# Altium schematic sheet Power.SchDoc
size A2
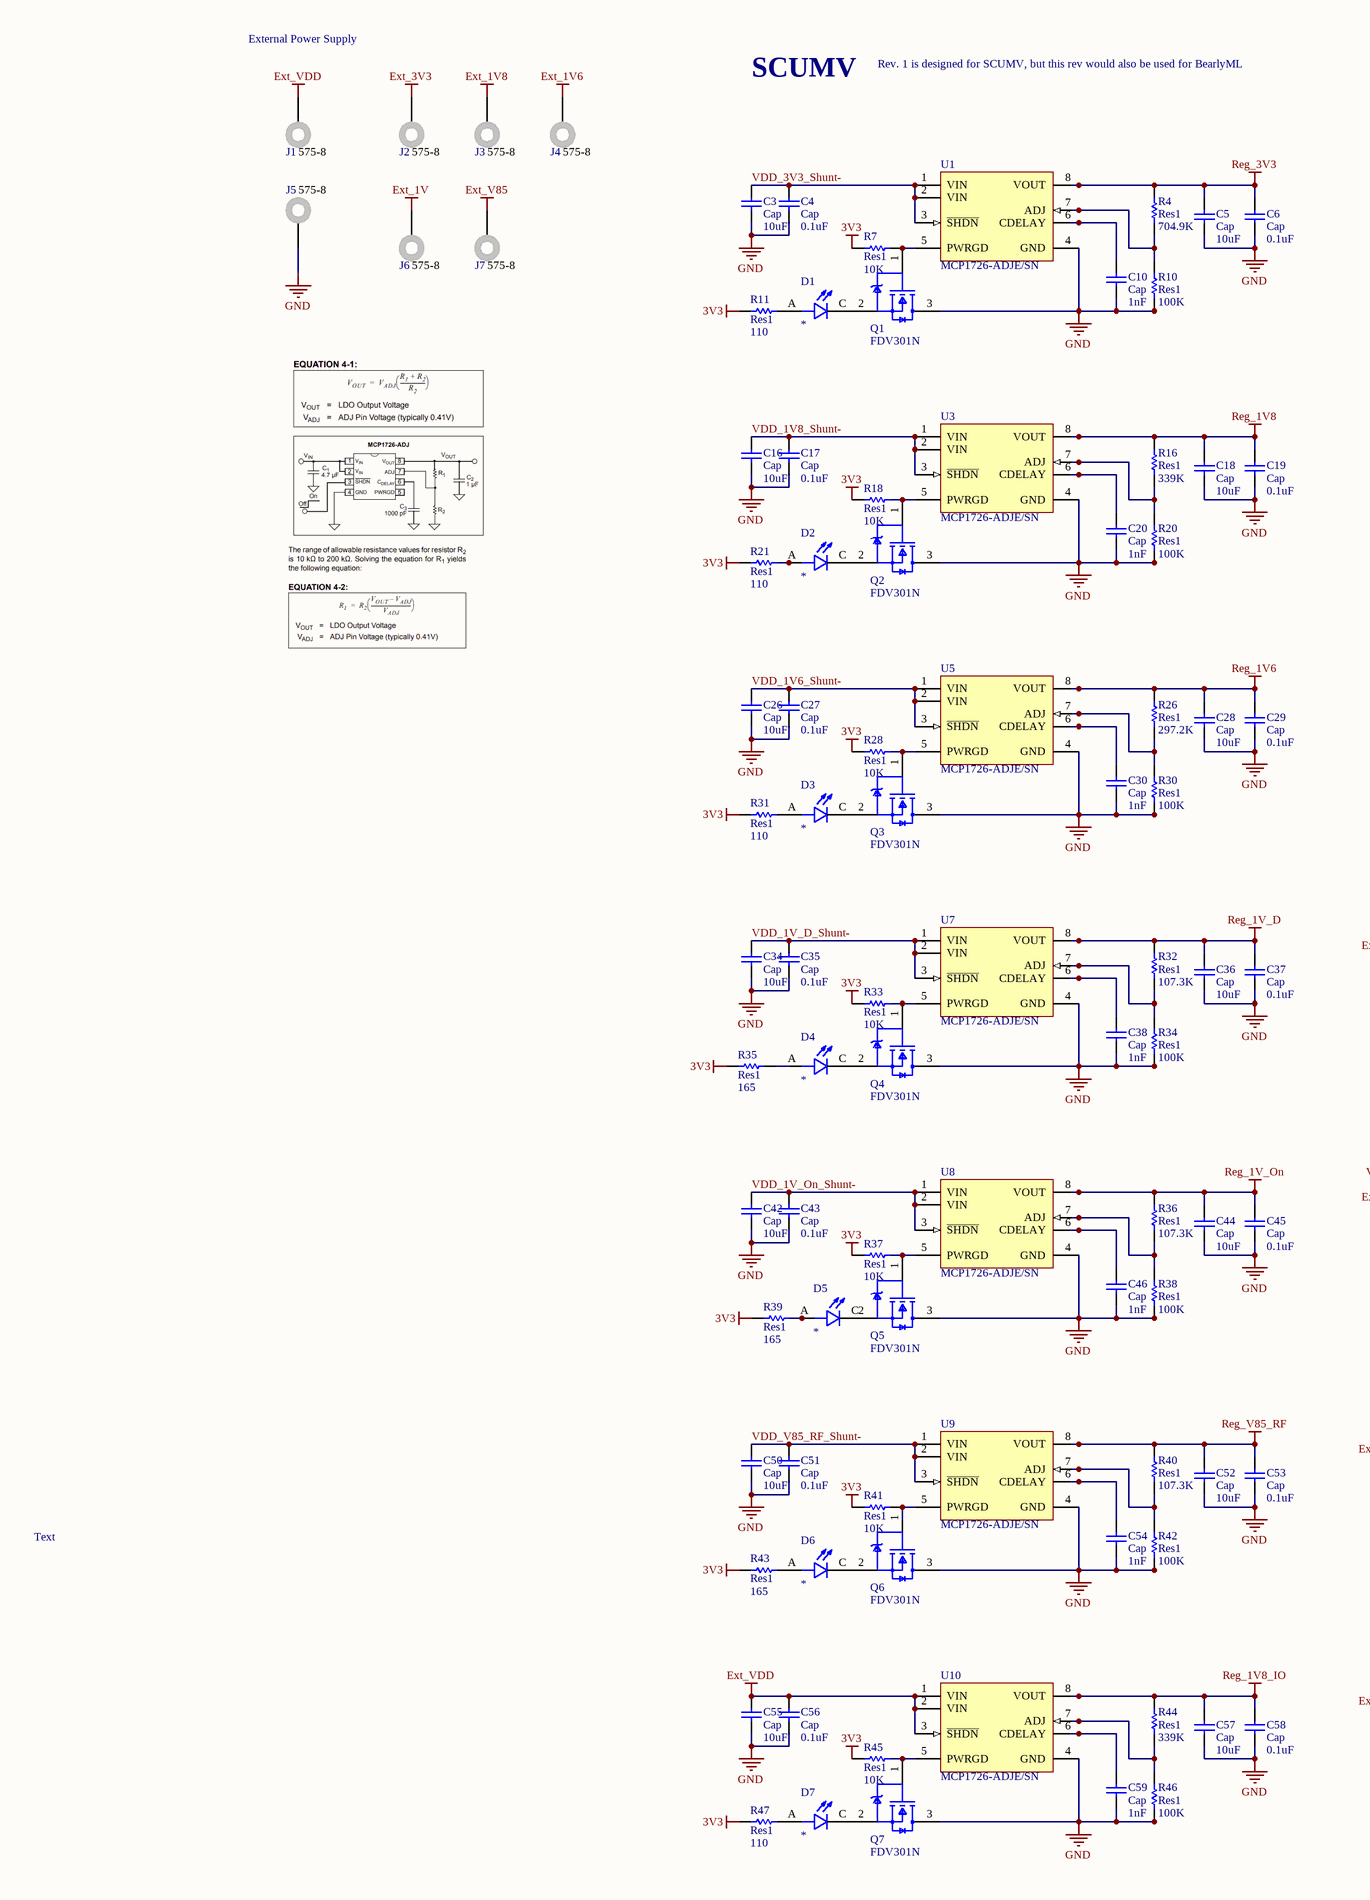
[diagram p0: Power.SchDoc, left]
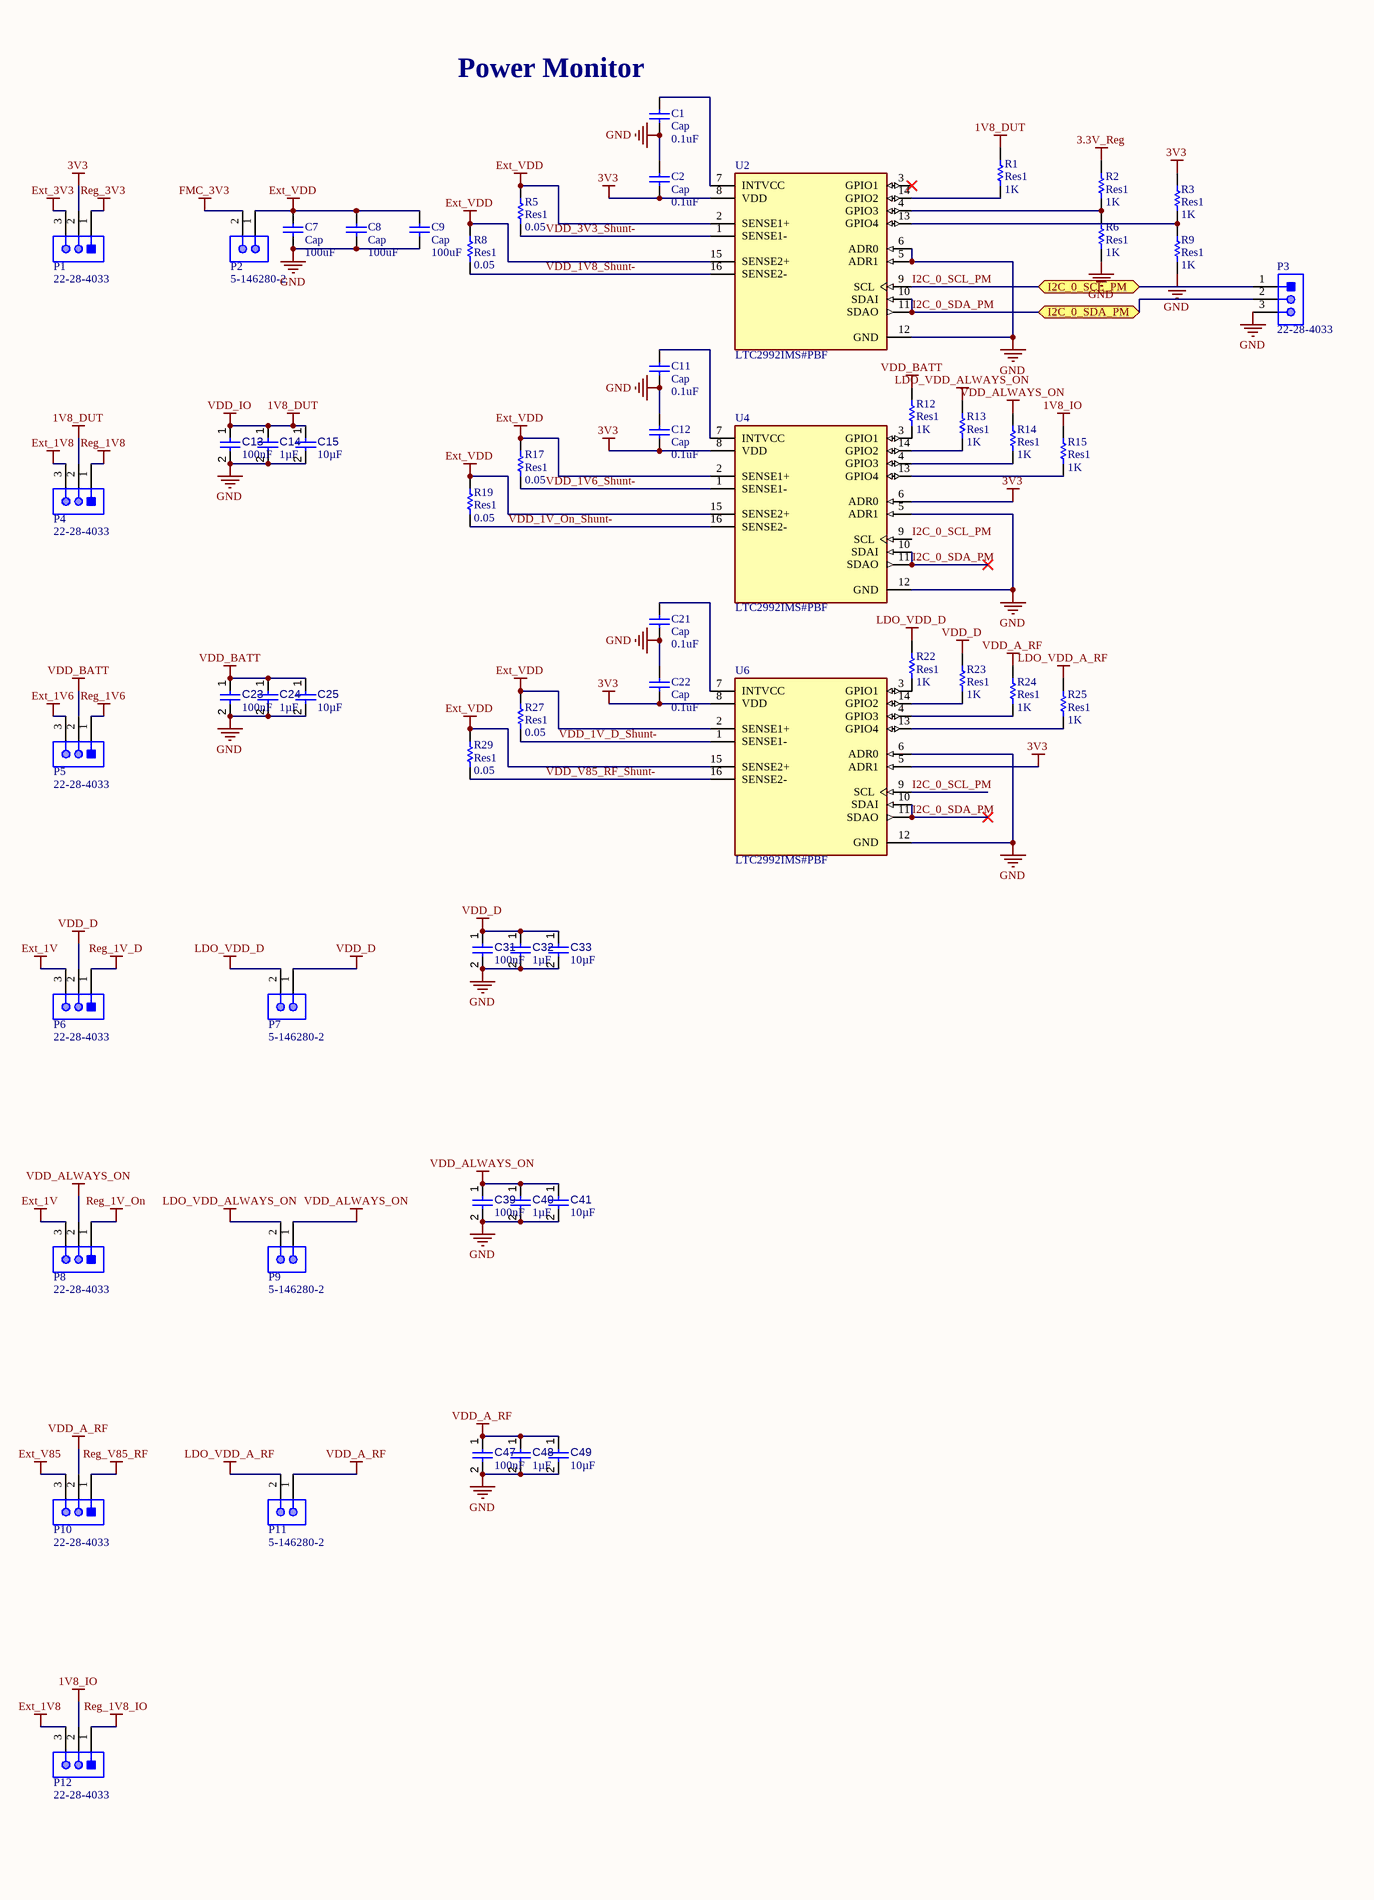
[diagram p1: Power.SchDoc, right]

## Parts
C1  Cap  value 0.1uF  [0603]
C2  Cap  value 0.1uF  [0603]
C3  Cap  value 10uF  [0805]
C4  Cap  value 0.1uF  [0603]
C5  Cap  value 10uF  [0805]
C6  Cap  value 0.1uF  [0603]
C7  Cap  value 100uF  [0805]
C8  Cap  value 100uF  [0805]
C9  Cap  value 100uF  [0805]
C10  Cap  value 1nF  [0603]
C11  Cap  value 0.1uF  [0603]
C12  Cap  value 0.1uF  [0603]
C13  value 100nF  [CAPC0402(1005)60_L]  (hidden comment: Capacitor 100nF +/-20% 10V 0402)
C14  value 1µF  [CAPC0402(1005)60_L]  (hidden comment: Capacitor 1µF +/-20% 10V 0402)
C15  value 10µF  [CAPC0402(1005)60_L]  (hidden comment: Capacitor 10µF +/-40% 6.3V 0402)
C16  Cap  value 10uF  [0805]
C17  Cap  value 0.1uF  [0603]
C18  Cap  value 10uF  [0805]
C19  Cap  value 0.1uF  [0603]
C20  Cap  value 1nF  [0603]
C21  Cap  value 0.1uF  [0603]
C22  Cap  value 0.1uF  [0603]
C23  value 100nF  [CAPC0402(1005)60_L]  (hidden comment: Capacitor 100nF +/-20% 10V 0402)
C24  value 1µF  [CAPC0402(1005)60_L]  (hidden comment: Capacitor 1µF +/-20% 10V 0402)
C25  value 10µF  [CAPC0402(1005)60_L]  (hidden comment: Capacitor 10µF +/-40% 6.3V 0402)
C26  Cap  value 10uF  [0805]
C27  Cap  value 0.1uF  [0603]
C28  Cap  value 10uF  [0805]
C29  Cap  value 0.1uF  [0603]
C30  Cap  value 1nF  [0603]
C31  value 100nF  [CAPC0402(1005)60_L]  (hidden comment: Capacitor 100nF +/-20% 10V 0402)
C32  value 1µF  [CAPC0402(1005)60_L]  (hidden comment: Capacitor 1µF +/-20% 10V 0402)
C33  value 10µF  [CAPC0402(1005)60_L]  (hidden comment: Capacitor 10µF +/-40% 6.3V 0402)
C34  Cap  value 10uF  [0805]
C35  Cap  value 0.1uF  [0603]
C36  Cap  value 10uF  [0805]
C37  Cap  value 0.1uF  [0603]
C38  Cap  value 1nF  [0603]
C39  value 100nF  [CAPC0402(1005)60_L]  (hidden comment: Capacitor 100nF +/-20% 10V 0402)
C40  value 1µF  [CAPC0402(1005)60_L]  (hidden comment: Capacitor 1µF +/-20% 10V 0402)
C41  value 10µF  [CAPC0402(1005)60_L]  (hidden comment: Capacitor 10µF +/-40% 6.3V 0402)
C42  Cap  value 10uF  [0805]
C43  Cap  value 0.1uF  [0603]
C44  Cap  value 10uF  [0805]
C45  Cap  value 0.1uF  [0603]
C46  Cap  value 1nF  [0603]
C47  value 100nF  [CAPC0402(1005)60_L]  (hidden comment: Capacitor 100nF +/-20% 10V 0402)
C48  value 1µF  [CAPC0402(1005)60_L]  (hidden comment: Capacitor 1µF +/-20% 10V 0402)
C49  value 10µF  [CAPC0402(1005)60_L]  (hidden comment: Capacitor 10µF +/-40% 6.3V 0402)
C50  Cap  value 10uF  [0805]
C51  Cap  value 0.1uF  [0603]
C52  Cap  value 10uF  [0805]
C53  Cap  value 0.1uF  [0603]
C54  Cap  value 1nF  [0603]
C55  Cap  value 10uF  [0805]
C56  Cap  value 0.1uF  [0603]
C57  Cap  value 10uF  [0805]
C58  Cap  value 0.1uF  [0603]
C59  Cap  value 1nF  [0603]
D1  LTW-C191DS5  [LED0603]  (value not drawn)
D2  LTW-C191DS5  [LED0603]  (value not drawn)
D3  LTW-C191DS5  [LED0603]  (value not drawn)
D4  LTW-C191DS5  [LED0603]  (value not drawn)
D5  LTW-C191DS5  [LED0603]  (value not drawn)
D6  LTW-C191DS5  [LED0603]  (value not drawn)
D7  LTW-C191DS5  [LED0603]  (value not drawn)
J1  575-8  [KSTN-575-8]
J2  575-8  [KSTN-575-8]
J3  575-8  [KSTN-575-8]
J4  575-8  [KSTN-575-8]
J5  575-8  [KSTN-575-8]
J6  575-8  [KSTN-575-8]
J7  575-8  [KSTN-575-8]
P1  22-28-4033  [MOLX-22-28-4033_V]
P2  5-146280-2  [TECO-5-146280-2_V]
P3  22-28-4033  [MOLX-22-28-4033_V]
P4  22-28-4033  [MOLX-22-28-4033_V]
P5  22-28-4033  [MOLX-22-28-4033_V]
P6  22-28-4033  [MOLX-22-28-4033_V]
P7  5-146280-2  [TECO-5-146280-2_V]
P8  22-28-4033  [MOLX-22-28-4033_V]
P9  5-146280-2  [TECO-5-146280-2_V]
P10  22-28-4033  [MOLX-22-28-4033_V]
P11  5-146280-2  [TECO-5-146280-2_V]
P12  22-28-4033  [MOLX-22-28-4033_V]
Q1  FDV301N  [FP-318-08-MFG]
Q2  FDV301N  [FP-318-08-MFG]
Q3  FDV301N  [FP-318-08-MFG]
Q4  FDV301N  [FP-318-08-MFG]
Q5  FDV301N  [FP-318-08-MFG]
Q6  FDV301N  [FP-318-08-MFG]
Q7  FDV301N  [FP-318-08-MFG]
R1  Res1  value 1K  [0603]
R2  Res1  value 1K  [0603]
R3  Res1  value 1K  [0603]
R4  Res1  value 704.9K  [0603]
R5  Res1  value 0.05  [0603]
R6  Res1  value 1K  [0603]
R7  Res1  value 10K  [0603]
R8  Res1  value 0.05  [0603]
R9  Res1  value 1K  [0603]
R10  Res1  value 100K  [0603]
R11  Res1  value 110  [0603]
R12  Res1  value 1K  [0603]
R13  Res1  value 1K  [0603]
R14  Res1  value 1K  [0603]
R15  Res1  value 1K  [0603]
R16  Res1  value 339K  [0603]
R17  Res1  value 0.05  [0603]
R18  Res1  value 10K  [0603]
R19  Res1  value 0.05  [0603]
R20  Res1  value 100K  [0603]
R21  Res1  value 110  [0603]
R22  Res1  value 1K  [0603]
R23  Res1  value 1K  [0603]
R24  Res1  value 1K  [0603]
R25  Res1  value 1K  [0603]
R26  Res1  value 297.2K  [0603]
R27  Res1  value 0.05  [0603]
R28  Res1  value 10K  [0603]
R29  Res1  value 0.05  [0603]
R30  Res1  value 100K  [0603]
R31  Res1  value 110  [0603]
R32  Res1  value 107.3K  [0603]
R33  Res1  value 10K  [0603]
R34  Res1  value 100K  [0603]
R35  Res1  value 165  [0603]
R36  Res1  value 107.3K  [0603]
R37  Res1  value 10K  [0603]
R38  Res1  value 100K  [0603]
R39  Res1  value 165  [0603]
R40  Res1  value 107.3K  [0603]
R41  Res1  value 10K  [0603]
R42  Res1  value 100K  [0603]
R43  Res1  value 165  [0603]
R44  Res1  value 339K  [0603]
R45  Res1  value 10K  [0603]
R46  Res1  value 100K  [0603]
R47  Res1  value 110  [0603]
U1  MCP1726-ADJE/SN  [SOIC-SN8_N]
U2  LTC2992IMS#PBF  [FP-MS-16-05-08-1669-IPC_C]
U3  MCP1726-ADJE/SN  [SOIC-SN8_N]
U4  LTC2992IMS#PBF  [FP-MS-16-05-08-1669-IPC_C]
U5  MCP1726-ADJE/SN  [SOIC-SN8_N]
U6  LTC2992IMS#PBF  [FP-MS-16-05-08-1669-IPC_C]
U7  MCP1726-ADJE/SN  [SOIC-SN8_N]
U8  MCP1726-ADJE/SN  [SOIC-SN8_N]
U9  MCP1726-ADJE/SN  [SOIC-SN8_N]
U10  MCP1726-ADJE/SN  [SOIC-SN8_N]

## Ports
I2C_0_SCL_PM (bidir), I2C_0_SDA_PM (bidir)

## Nets
1V8_DUT: C13.1 C14.1 C15.1 P4.2 R1.1  [also labelled VDD_IO]
1V8_IO: P12.2 R15.1
3.3V_Reg: R2.1
3V3: C2.2 C12.2 C22.2 P1.2 R3.1 R7.1 R11.1 R18.1 R21.1 R28.1 R31.1 R33.1 R35.1 R37.1 R39.1 R41.1 R43.1 R45.1 R47.1 U2.8(VDD) U4.6(ADR0) U4.8(VDD) U6.5(ADR1) U6.8(VDD)
Ext_1V: J6.1 P6.3 P8.3
Ext_1V6: J4.1 P5.3
Ext_1V8: J3.1 P4.3 P12.3
Ext_3V3: J2.1 P1.3
Ext_V85: J7.1 P10.3
Ext_VDD: C7.2 C8.2 C9.2 C55.2 C56.2 J1.1 P2.1 R5.2 R8.2 R17.2 R19.2 R27.2 R29.2 U2.2(SENSE1+) U2.15(SENSE2+) U4.2(SENSE1+) U4.15(SENSE2+) U6.2(SENSE1+) U6.15(SENSE2+) U10.1(VIN) U10.2(VIN) U10.3(~{SHDN})
FMC_3V3: P2.2
GND: C1.2 C2.1 C3.1 C4.1 C5.1 C6.1 C7.1 C8.1 C9.1 C10.1 C11.2 C12.1 C13.2 C14.2 C15.2 C16.1 C17.1 C18.1 C19.1 C20.1 C21.2 C22.1 C23.2 C24.2 C25.2 C26.1 C27.1 C28.1 C29.1 C30.1 C31.2 C32.2 C33.2 C34.1 C35.1 C36.1 C37.1 C38.1 C39.2 C40.2 C41.2 C42.1 C43.1 C44.1 C45.1 C46.1 C47.2 C48.2 C49.2 C50.1 C51.1 C52.1 C53.1 C54.1 C55.1 C56.1 C57.1 C58.1 C59.1 J5.1 P3.3 Q1.3(D) Q2.3(D) Q3.3(D) Q4.3(D) Q5.3(D) Q6.3(D) Q7.3(D) R6.2 R9.2 R10.1 R20.1 R30.1 R34.1 R38.1 R42.1 R46.1 U1.4(GND) U2.5(ADR1) U2.6(ADR0) U2.12(GND) U3.4(GND) U4.5(ADR1) U4.12(GND) U5.4(GND) U6.6(ADR0) U6.12(GND) U7.4(GND) U8.4(GND) U9.4(GND) U10.4(GND)
LDO_VDD_A_RF: P11.2 R25.1
LDO_VDD_ALWAYS_ON: P9.2 R13.1
LDO_VDD_D: P7.2 R22.1
Reg_1V6: C28.2 C29.2 P5.1 R26.2 U5.8(VOUT)
Reg_1V8: C18.2 C19.2 P4.1 R16.2 U3.8(VOUT)
Reg_1V8_IO: C57.2 C58.2 P12.1 R44.2 U10.8(VOUT)
Reg_1V_D: C36.2 C37.2 P6.1 R32.2 U7.8(VOUT)
Reg_1V_On: C44.2 C45.2 P8.1 R36.2 U8.8(VOUT)
Reg_3V3: C5.2 C6.2 P1.1 R4.2 U1.8(VOUT)
Reg_V85_RF: C52.2 C53.2 P10.1 R40.2 U9.8(VOUT)
VDD_A_RF: C47.1 C48.1 C49.1 P10.2 P11.1 R24.1
VDD_ALWAYS_ON: C39.1 C40.1 C41.1 P8.2 P9.1 R14.1
VDD_BATT: C23.1 C24.1 C25.1 P5.2 R12.1
VDD_D: C31.1 C32.1 C33.1 P6.2 P7.1 R23.1
I2C_0_SCL_PM: P3.1 U2.9(SCL) U4.9(SCL) U6.9(SCL) ; port I2C_0_SCL_PM
I2C_0_SDA_PM: P3.2 U2.10(SDAI) U2.11(SDAO) U4.10(SDAI) U4.11(SDAO) U6.10(SDAI) U6.11(SDAO) ; port I2C_0_SDA_PM
VDD_1V6_Shunt-: C26.2 C27.2 R17.1 U4.1(SENSE1-) U5.1(VIN) U5.2(VIN) U5.3(~{SHDN})
VDD_1V8_Shunt-: C16.2 C17.2 R8.1 U2.16(SENSE2-) U3.1(VIN) U3.2(VIN) U3.3(~{SHDN})
VDD_1V_D_Shunt-: C34.2 C35.2 R27.1 U6.1(SENSE1-) U7.1(VIN) U7.2(VIN) U7.3(~{SHDN})
VDD_1V_On_Shunt-: C42.2 C43.2 R19.1 U4.16(SENSE2-) U8.1(VIN) U8.2(VIN) U8.3(~{SHDN})
VDD_3V3_Shunt-: C3.2 C4.2 R5.1 U1.1(VIN) U1.2(VIN) U1.3(~{SHDN}) U2.1(SENSE1-)
VDD_V85_RF_Shunt-: C50.2 C51.2 R29.1 U6.16(SENSE2-) U9.1(VIN) U9.2(VIN) U9.3(~{SHDN})
NetC1_1: C1.1 U2.7(INTVCC)
NetC10_2: C10.2 U1.6(CDELAY)
NetC11_1: C11.1 U4.7(INTVCC)
NetC20_2: C20.2 U3.6(CDELAY)
NetC21_1: C21.1 U6.7(INTVCC)
NetC30_2: C30.2 U5.6(CDELAY)
NetC38_2: C38.2 U7.6(CDELAY)
NetC46_2: C46.2 U8.6(CDELAY)
NetC54_2: C54.2 U9.6(CDELAY)
NetC59_2: C59.2 U10.6(CDELAY)
NetD1_A: D1.A R11.2
NetD1_C: D1.C Q1.2(S)
NetD2_A: D2.A R21.2
NetD2_C: D2.C Q2.2(S)
NetD3_A: D3.A R31.2
NetD3_C: D3.C Q3.2(S)
NetD4_A: D4.A R35.2
NetD4_C: D4.C Q4.2(S)
NetD5_A: D5.A R39.2
NetD6_A: D6.A R43.2
NetD6_C: D6.C Q6.2(S)
NetD7_A: D7.A R47.2
NetD7_C: D7.C Q7.2(S)
NetQ1_1: Q1.1(G) R7.2 U1.5(PWRGD)
NetQ2_1: Q2.1(G) R18.2 U3.5(PWRGD)
NetQ3_1: Q3.1(G) R28.2 U5.5(PWRGD)
NetQ4_1: Q4.1(G) R33.2 U7.5(PWRGD)
NetQ5_1: Q5.1(G) R37.2 U8.5(PWRGD)
NetQ6_1: Q6.1(G) R41.2 U9.5(PWRGD)
NetQ7_1: Q7.1(G) R45.2 U10.5(PWRGD)
NetR1_2: R1.2 U2.14(GPIO2)
NetR2_2: R2.2 R6.1 U2.4(GPIO3)
NetR3_2: R3.2 R9.1 U2.13(GPIO4)
NetR4_1: R4.1 R10.2 U1.7(ADJ)
NetR12_2: R12.2 U4.3(GPIO1)
NetR13_2: R13.2 U4.14(GPIO2)
NetR14_2: R14.2 U4.4(GPIO3)
NetR15_2: R15.2 U4.13(GPIO4)
NetR16_1: R16.1 R20.2 U3.7(ADJ)
NetR22_2: R22.2 U6.3(GPIO1)
NetR23_2: R23.2 U6.14(GPIO2)
NetR24_2: R24.2 U6.4(GPIO3)
NetR25_2: R25.2 U6.13(GPIO4)
NetR26_1: R26.1 R30.2 U5.7(ADJ)
NetR32_1: R32.1 R34.2 U7.7(ADJ)
NetR36_1: R36.1 R38.2 U8.7(ADJ)
NetR40_1: R40.1 R42.2 U9.7(ADJ)
NetR44_1: R44.1 R46.2 U10.7(ADJ)

Not connected (* = marked no-connect by the designer): D5 C; Q5 2(S); U2 3(GPIO1)*

## Notes on the sheet
- External Power Supply
- Rev. 1 is designed for SCUMV, but this rev would also be used for BearlyML
- SCUMV
- (near C1) Power Monitor
- Text

## Library data of the parts
C1-C12 C16-C22 C26-C30 C34-C38 C42-C46 C50-C59 = Cap: Capacitor; Published: 8-Jun-2000; LatestRevisionDate: 17-Jul-2002; LatestRevisionNote: Re-released for DXP Platform.; PackageReference: RAD-0.3; Publisher: Altium Limited; PackageDescription: Radial Cap, Thru-Hole; 2 Leads; 0.3 in Pin Spacing
C13 C23 C31 C39 C47 = CMP-001-00061-3: Chip Capacitor, 100nF +/-20%, 10V, 0402, Thickness 0.6 mm; Tolerance: 20%; Mounting Technology: SMT; Voltage Rating: 10V; Max Operating Temperature: 85°C; Pins: 2; Case/Package: 0402; Min Operating Temperature: -55°C
C14 C24 C32 C40 C48 = CMP-001-00063-3: Chip Capacitor, 1µF +/-20%, 10V, 0402, Thickness 0.6 mm; Tolerance: 10%; Mounting Technology: SMT; Max Operating Temperature: 85°C; Voltage Rating: 10V; Pins: 2; Case/Package: 0402; Min Operating Temperature: -55°C
C15 C25 C33 C41 C49 = CMP-001-00074-3: Chip Capacitor, 10µF +/-40%, 6.3V, 0402, Thickness 0.6 mm; Tolerance: 10%; Case/Package: 0402; Pins: 2; Mounting Technology: SMT; Voltage Rating: 6.3V; Max Operating Temperature: 85°C; Min Operating Temperature: -55°C
D1-D7 = CMP-022-000000-2: White LED Indication - Discrete 2.93V 0603 _1608 Metric_; MF: Lite-On Inc.; Price: None; MP: LTW-C191DS5; Design Item ID: LTW-C191DS5; Availability: Unavailable; SnapEDA_Link: https://www.snapeda.com/parts/LTW-C191DS5/Lite-On%20Inc./view-part/199753/?ref=snap; Value: *; Source: SnapEDAsch.SchLib; Pin Count: 2; Component Type: Standard; Package: 0603 Lite-On
J1-J7 = CMP-1672-00007-5: Non-Insulated Jack, Through Hole, RoHS, Bulk; Manufacturer: Keystone; PackageDescription: 1-Pin Through Hole Device, Dia 7.92 mm; PackageReference: 575-8; ComponentLink1Description: Manufacturer URL; Mounting Technology: Through Hole; ComponentLink2URL: http://www.keyelco.com/product-pdf.cfm?p=2379; ComponentLink2Description: Datasheet; DatasheetVersion: Rev. B, 11/1994; ComponentLink1URL: http://www.keyelco.com/
P1 P3-P6 P8 P10 P12 = CMP-1676-00001-5: Male Header, Pitch 2.54 mm, 1 x 3 Position, Height 8.38 mm, Tail Length 3.18 mm, RoHS, Bulk; Manufacturer: Molex; Rows: 1; Voltage Rating: 250 V; Current Rating: 4 A; Min Operating Temperature: 0 degC; Lead Pitch: 0.1 inch; Packaging: Bulk; Contact Finish: Gold; RoHSCompliant: true; Contact Material: Brass; PackageReference: 22-28-4033; REACH SVHC: Unknown; PackageDescription: Male Header, Pitch 2.54 mm, 1 x 3 Position, Height 8.38 mm, Tail Length 3.18 mm; ComponentLink2URL: http://www.molex.com/pdm_docs/sd/022284033_sd.pdf; Height: 8.38 mm; Mounting Technology: Through Hole; ComponentLink1Description: Manufacturer URL; Length: 7.62 mm; Mount: Through Hole; DatasheetVersion: Rev. G, 01/2012; Max Operating Temperature: 75 degC; ComponentLink2Description: Datasheet; Colour: Black; Pins: 3; Contact Plating: Gold; Package Quantity: 1; ComponentLink1URL: http://www.molex.com/
P2 P7 P9 P11 = CMP-2000-07492-1: Male Header, Pitch 2.54 mm, 1 x 2 Position, Height 8.21 mm, Tail Length 3.05 mm, -65 to 105 degC, RoHS, Bulk; Manufacturer: TE Connectivity; Mating Connector Lock: No(Without); Number of Positions: 2; Pitch: 2.54mm; PCB Mounting Orientation: Vertical; Keyed: No; Case\/Package: 100; Mating Post Length: 0.23inch; High Temperature Housing: Yes; Max Current Rating: 5A; PCB Thickness: 0.063inch; PCB Mount Retention: Without; Approvals: CSA; Current Rating: 3A; Radiation Hardening: No; Length: 4.67mm; Contact Mating Length: 0.23inch; Connector Type: Header; Number of Rows: 1; Termination Post Length: 0.12inch; Board Standoff: No(Without); Max Operating Temperature: 105degC; Contact Shape: Square; Selectively Loaded: No(Without); Gasket: No(Without); Number of Contacts: 2; Contact Gender: Male; Mating Alignment: No(Without); Manufacturer URL: http://www.te.com/; Datasheet URL: http://www.te.com/commerce/DocumentDelivery/DDEController?Action=showdoc&DocId=Customer+Drawing%7F146280%7FH1%7Fpdf%7FEnglish%7FENG_CD_146280_H1.pdf%7F5-146280-2; Mount: ThroughHole; Orientation: Straight; Packaging: Carton; Package Reference: 5-146280-2; Package Quantity: 500; Stabilizers: No(Without); Row Spacing: 2.54mm; Contact Material: CopperAlloy; Panel Mount Retention: No(Without); Datasheet Version: Rev. H1, 08/2016; Housing Colour: Black; Colour: Black; Package Description: Male Header, Pitch 2.54 mm, 1 x 2 Position, Height 8.21 mm, Tail Length 3.05 mm; Contact Plating: Matte; Housing Material: Polymer; Contact Protection: No(Without); Min Operating Temperature: -65degC; Mounting Technology: ThroughHole; Flammability Rating: UL94V-0; RoHSCompliant: true; Termination: ThroughHole; Depth: 2.34mm; High Speed Serial Data Connector: No
Q1-Q7 = CMP-2000-04935-2: MOSFET N-CH 25V 220MA SOT-23; Manufacturer: ON Semiconductor; Turn Off Delay Time: 3.5ns; Typ Forward Diode Voltage: 0.8V; Max Junction Temp: +150°C; Threshold Vgs Max: 1.06V; Threshold Vgs Min: 0.7V; Standoff Height: 0.01mm; Max Forward Diode Voltage: 1.2V; Number Of Channels: 1; Rthja Max: 357°C/W; Drain To Source Resistance: 3.1Ω; Input Capacitace At Vds: 9.5pF @ 10V; Gate Charge At Vgs: 0.49nC @ 4.5V; Transconductance: 0.2S; Turn On Delay Time: 3.2ns; Depletion Mode: False; Power Dissipation: 0.35W; Continuous Drain Current: 0.22A; Gate To Source Voltage: 8V; RoHS: TRUE; Lead Free: Yes; Temperature Range High: +150°C; Automotive: No; Height: 1.11mm; Category: Trans; Mouser Description: MOSFET N-Ch Digital; Drain To Source Voltage: 25V; Temperature: -55°C to +150°C; Ipc Land Pattern Name: SOT95P240X100-3; Device Class L1: Discrete Semiconductors; Octopart: https://octopart.com/fdv301n-on+semiconductor-84326713; Footprint Url: https://www.onsemi.com/pub/Collateral/318-08.PDF; Digikey Description: MOSFET N-CH 25V 220MA SOT-23; Drain To Source Breakdown Voltage: 25V; Temperature Range Low: -55°C; Number Of N Channels: 1; Device Class L3: MOSFETs; Package: 318-08; ComponentLink2URL: https://www.onsemi.com/pub/Collateral/FDV301N-D.PDF; Manufacturer Part Number: FDV301N; Device Class L2: Transistors; ComponentLink2Description: Datasheet
R1-R47 = Res1: Resistor; Published: 8-Jun-2000; LatestRevisionDate: 17-Jul-2002; LatestRevisionNote: Re-released for DXP Platform.; PackageReference: AXIAL-0.3; Publisher: Altium Limited; PackageDescription: Axial Device, Thru-Hole; 2 Leads; 0.3 in Pin Spacing
U1 U3 U5 U7-U10 = CMP-0136-00180-1: 1A, Low Voltage, Low Quiescent Current LDO Regulator, 8-Pin SOIC 150mil, Extended Temperature; Code_IPC: SOIC127P600-8; DatasheetVersion: revC, Aug-2007; PackageVersion: revBB, Aug-2009; Code_JEDEC: MS-012; PackageDescription: 8-Lead Plastic Small Outline (SN) - Narrow, 3.90mm Body [SOIC]; PackageReference: SOIC-SN8
U2 U4 U6 = CMP-09131-000077-1: IC PWR MONITOR DUAL WIDE 16MSOP; RoHS Compliant: Yes